# Altium schematic sheet LS_MAIN.SchDoc
size A4
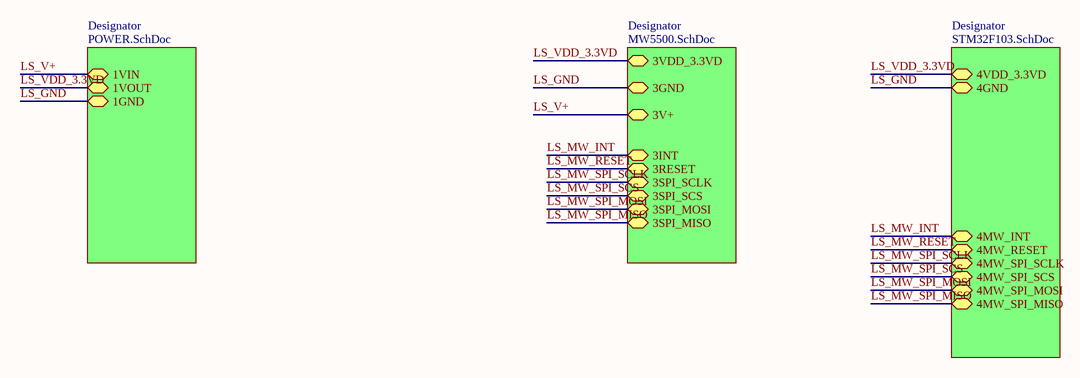
[diagram p0: LS_MAIN.SchDoc]

## Sub-sheets
Designator = POWER.SchDoc: 1VIN, 1VOUT, 1GND
Designator = STM32F103.SchDoc: 4VDD_3.3VD, 4GND, 4MW_INT, 4MW_RESET, 4MW_SPI_SCLK, 4MW_SPI_SCS, 4MW_SPI_MOSI, 4MW_SPI_MISO
Designator = MW5500.SchDoc: 3GND, 3VDD_3.3VD, 3INT, 3SPI_SCLK, 3RESET, 3SPI_SCS, 3SPI_MOSI, 3SPI_MISO, 3V+

## Nets
LS_GND: sheet Designator/1GND, sheet Designator/4GND, sheet Designator/3GND
LS_MW_INT: sheet Designator/4MW_INT, sheet Designator/3INT
LS_MW_RESET: sheet Designator/4MW_RESET, sheet Designator/3RESET
LS_MW_SPI_MISO: sheet Designator/4MW_SPI_MISO, sheet Designator/3SPI_MISO
LS_MW_SPI_MOSI: sheet Designator/4MW_SPI_MOSI, sheet Designator/3SPI_MOSI
LS_MW_SPI_SCLK: sheet Designator/4MW_SPI_SCLK, sheet Designator/3SPI_SCLK
LS_MW_SPI_SCS: sheet Designator/4MW_SPI_SCS, sheet Designator/3SPI_SCS
LS_V+: sheet Designator/1VIN, sheet Designator/3V+
LS_VDD_3.3VD: sheet Designator/1VOUT, sheet Designator/4VDD_3.3VD, sheet Designator/3VDD_3.3VD